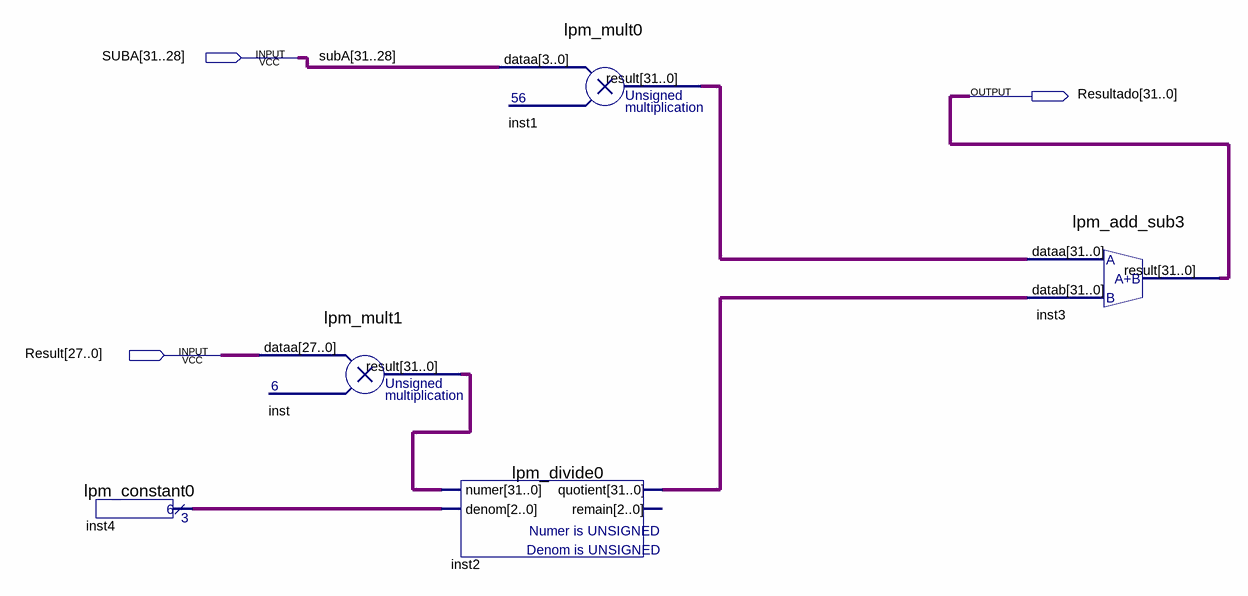
[diagram p0: schematic sheet]
// Quartus schematic Concatenador.bdf as structural Verilog: 5 symbols, 3 pins
module Concatenador (
  input  [31:28] SUBA,
  input  [27:0] Result,
  output [31:0] Resultado
);

  wire [2:0] inst4_result;
  wire [31:0] inst1_result, inst2_quotient, inst_result;

  lpm_constant0 inst4 (.result(inst4_result));
  lpm_mult1 inst (.dataa(Result), .result(inst_result));
  lpm_mult0 inst1 (.dataa(SUBA), .result(inst1_result));
  lpm_divide0 inst2 (.numer(inst_result), .denom(inst4_result), .quotient(inst2_quotient));  // open: remain
  lpm_add_sub3 inst3 (.dataa(inst1_result), .datab(inst2_quotient), .result(Resultado));
endmodule
